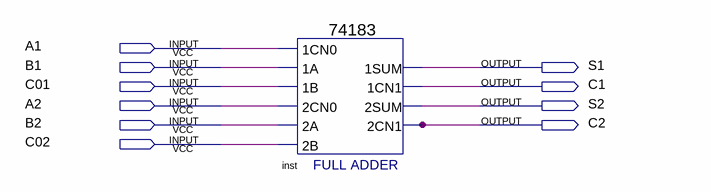
[diagram p0: schematic sheet]
// Quartus schematic 2full_add.bdf as structural Verilog: 1 symbols, 10 pins
module \2full_add  (
  input  A1,
  input  B1,
  input  C01,
  input  A2,
  input  B2,
  input  C02,
  output S1,
  output C1,
  output S2,
  output C2
);

  \74183  inst (
    .\2CN0 (A2), .\2A (B2), .\1B (C01), .\1A (B1), .\2B (C02), .\1CN0 (A1), .\1CN1 (C1), .\2SUM (S2),
    .\2CN1 (C2), .\1SUM (S1));
endmodule
